# Altium schematic sheet FAN_Board_Control_v1_040116.SchDoc
size A3
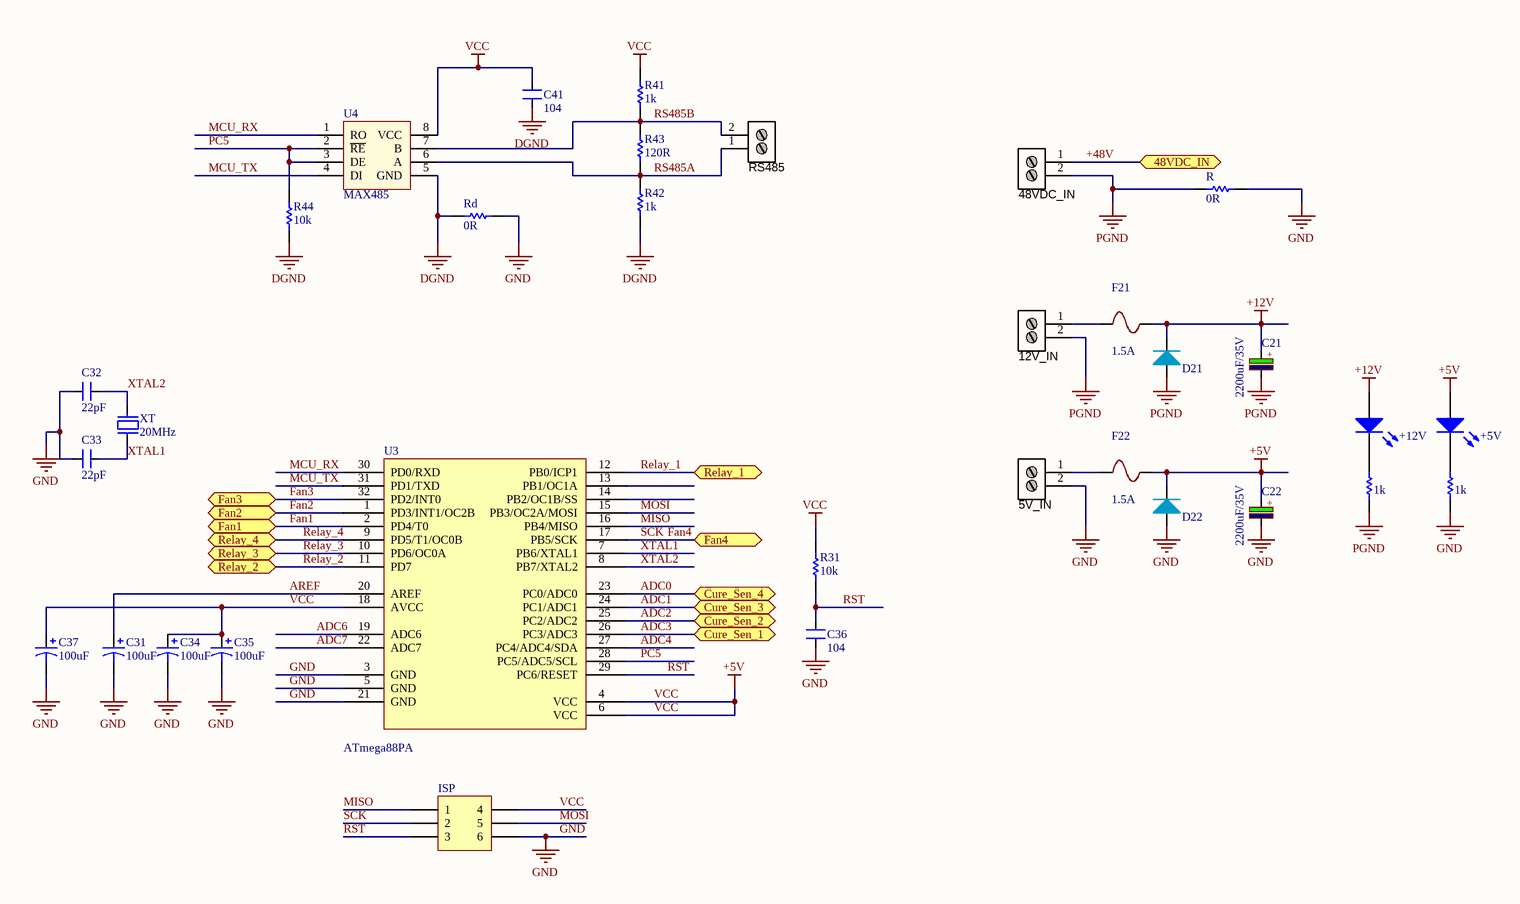
[diagram p0: FAN_Board_Control_v1_040116.SchDoc]

## Parts
5V_IN  Stackable ScrewTerm  [2P_PCB_ScrewTerm_200mil]  (value not drawn)
12V_IN  Stackable ScrewTerm  [2P_PCB_ScrewTerm_200mil]  (value not drawn)
48VDC_IN  Stackable ScrewTerm  [2P_PCB_ScrewTerm_200mil]  (value not drawn)
+5V  Led  [LED 5mm RED]  (value not drawn)
+12V  Led  [LED 5mm RED]  (value not drawn)
C21  2200uF/35V  [CP_1000uF_25V]
C22  2200uF/35V  [CP_1000uF_25V]
C31  value 100uF  [CAPC2012N_F]  (hidden comment: Cap)
C32  value 22pF  [CAPC1608N]  (hidden comment: CAP NP)
C33  value 22pF  [CAPC1608N]  (hidden comment: CAP NP)
C34  value 100uF  [CAPC2012N_F]  (hidden comment: Cap)
C35  value 100uF  [CAPC2012N_F]  (hidden comment: Cap)
C36  value 104  [CAPC1608N]  (hidden comment: CAP NP)
C37  value 100uF  [CAPC2012N_F]  (hidden comment: Cap)
C41  value 104  [CAPC2012N_F]  (hidden comment: 100nF/104)
D21  Diode  [DO-214AC]  (value not drawn)
D22  Diode  [DO-214AC]  (value not drawn)
F21  1.5A  [FUSE_SR-5-BK]
F22  1.5A  [FUSE_SR-5-BK]
ISP  Header 3X2A  [HDR2X3_CEN]  (value not drawn)
R  value 0R  [RESTH_AXIAL-0.4]  (hidden comment: Res)
R21  value 1k  [RESC2012N_F]  (hidden comment: Res_0805_1k)
R22  value 1k  [RESC2012N_F]  (hidden comment: Res_0805_1k)
R31  value 10k  [RESC1608N_ZERO]  (hidden comment: Res)
R41  1k  [RESC2012N_F]
R42  1k  [RESC2012N_F]
R43  value 120R  [RESC2012N_F]  (hidden comment: 330R)
R44  value 10k  [RESC2012N_F]  (hidden comment: 330R)
Rd  value 0R  [RESC2012N_F]  (hidden comment: Res)
RS485  Stackable ScrewTerm  [2P_PCB1]  (value not drawn)
U3  ATmega88PA  [32PIN]
U4  MAX485  [SO-8]
XT  20MHz  [XT2]

## Ports
48VDC_IN, Cure_Sen_1, Cure_Sen_2, Cure_Sen_3, Cure_Sen_4, Fan1, Fan2, Fan3, Fan4, Relay_1, Relay_2, Relay_3, Relay_4

## Nets
+12V: +12V.1(A) C21.1 D21.2(K) F21.2
DGND: C41.1 R42.1 R44.1 Rd.1 U4.5(GND)
GND: 5V_IN.2 C22.2 C31.2 C32.2 C33.2 C34.2 C35.2 C36.1 C37.2 D22.1(A) ISP.6 R.2 R22.2 Rd.2 U3.3(GND) U3.5(GND) U3.21(GND)
PGND: 12V_IN.2 48VDC_IN.2 C21.2 D21.1(A) R.1 R21.2
VCC: +5V.1(A) C22.1 C34.1 C35.1 C37.1 C41.2 D22.2(K) F22.2 ISP.4 R31.2 R41.2 U3.4(VCC) U3.6(VCC) U3.18(AVCC) U4.8(VCC)  [also labelled +5V]
+48V: 48VDC_IN.1 ; port 48VDC_IN
ADC0: U3.23(PC0/ADC0) ; port Cure_Sen_4
ADC1: U3.24(PC1/ADC1) ; port Cure_Sen_3
ADC2: U3.25(PC2/ADC2) ; port Cure_Sen_2
ADC3: U3.26(PC3/ADC3) ; port Cure_Sen_1
ADC4: U3.27(PC4/ADC4/SDA)
ADC6: U3.19(ADC6)
ADC7: U3.22(ADC7)
AREF: C31.1 U3.20(AREF)
Fan1: U3.2(PD4/T0) ; port Fan1
Fan2: U3.1(PD3/INT1/OC2B) ; port Fan2
Fan3: U3.32(PD2/INT0) ; port Fan3
Fan4: ISP.2 U3.17(PB5/SCK) ; port Fan4  [also labelled SCK]
MCU_RX: U3.30(PD0/RXD) U4.1(RO)
MCU_TX: U3.31(PD1/TXD) U4.4(DI)
MISO: ISP.1 U3.16(PB4/MISO)
MOSI: ISP.5 U3.15(PB3/OC2A/MOSI)
PC5: R44.2 U3.28(PC5/ADC5/SCL) U4.2(~{RE}) U4.3(DE)
Relay_1: U3.12(PB0/ICP1) ; port Relay_1
Relay_2: U3.11(PD7) ; port Relay_2
Relay_3: U3.10(PD6/OC0A) ; port Relay_3
Relay_4: U3.9(PD5/T1/OC0B) ; port Relay_4
RS485A: R42.2 R43.1 RS485.1 U4.6(A)
RS485B: R41.1 R43.2 RS485.2 U4.7(B)
RST: C36.2 ISP.3 R31.1 U3.29(PC6/RESET)
XTAL1: C33.1 U3.7(PB6/XTAL1) XT.1
XTAL2: C32.1 U3.8(PB7/XTAL2) XT.2
Net5V_IN_1: 5V_IN.1 F22.1
Net12V_IN_1: 12V_IN.1 F21.1
Net+5V_2: +5V.2(K) R22.1
Net+12V_2: +12V.2(K) R21.1

Not connected (* = marked no-connect by the designer): U3 13(PB1/OC1A) 14(PB2/OC1B/SS)

## Notes on the sheet
- (in symbol CP4) +

## Library data of the parts
5V_IN 12V_IN 48VDC_IN RS485 = 2P_ScrewTerm_90S_3.81MM: Terminal Block Screw Type THT 2-Position 3.81mm pitch; Manufacturer 1: Tyco Electronics; Manufacturer Part Number 1: 1776113-2; Value: 2 position; Pitch: 0.150" (3.81mm); Positions Per Level: 2; Package / Case: Side Entry; 3.81mm pitch; Category: Connectors Interconnects; Color: Black; Supplier 1: Digi-Key; Supplier Part Number 1: A97976-ND
+5V +12V = Led: pin to pad: 1>A 2>K
C21 C22 = CP4: Cap 1000uF/16V - 220uF/50V; Description 5: 4,7uF>10uF/250V_3,3uF>10uF/400V - 2,2uF>4,7uF/450V; Description 1: 2200uF-3300uF/6,3V - 1000uF-2200uF/10V; Description 2: 1000uF/16V - 470uF => 1000uF/25V - 100uF/100V; Description 3: 330uF>470uF/35V_220uF>470uF/50V_10uF>22uF/250V; Description 4: 220uF => 330uF/63V - 10uF =>33uF/160 - 200V; Value: 1000uF/16V
C41 = CAP NP
D21 D22 = Diode: pin to pad: 1>A 2>K
F21 F22 = Fuse
ISP = Header 3X2A: Header, 3-Pin, Dual row; LatestRevisionDate: 17-Jul-2002; LatestRevisionNote: Re-released for DXP Platform.; Publisher: Altium Limited
R21 R22 = Res
R41-R44 = Res: Tro dan
  R41 R42: Value: 1k
U3 = ATmega48/168/328
U4 = MAX485: RS232 - RS485 (Same sn75176)
XT = Crystal